# Altium project Power Supply.PrjPcb (part 1 of 3)
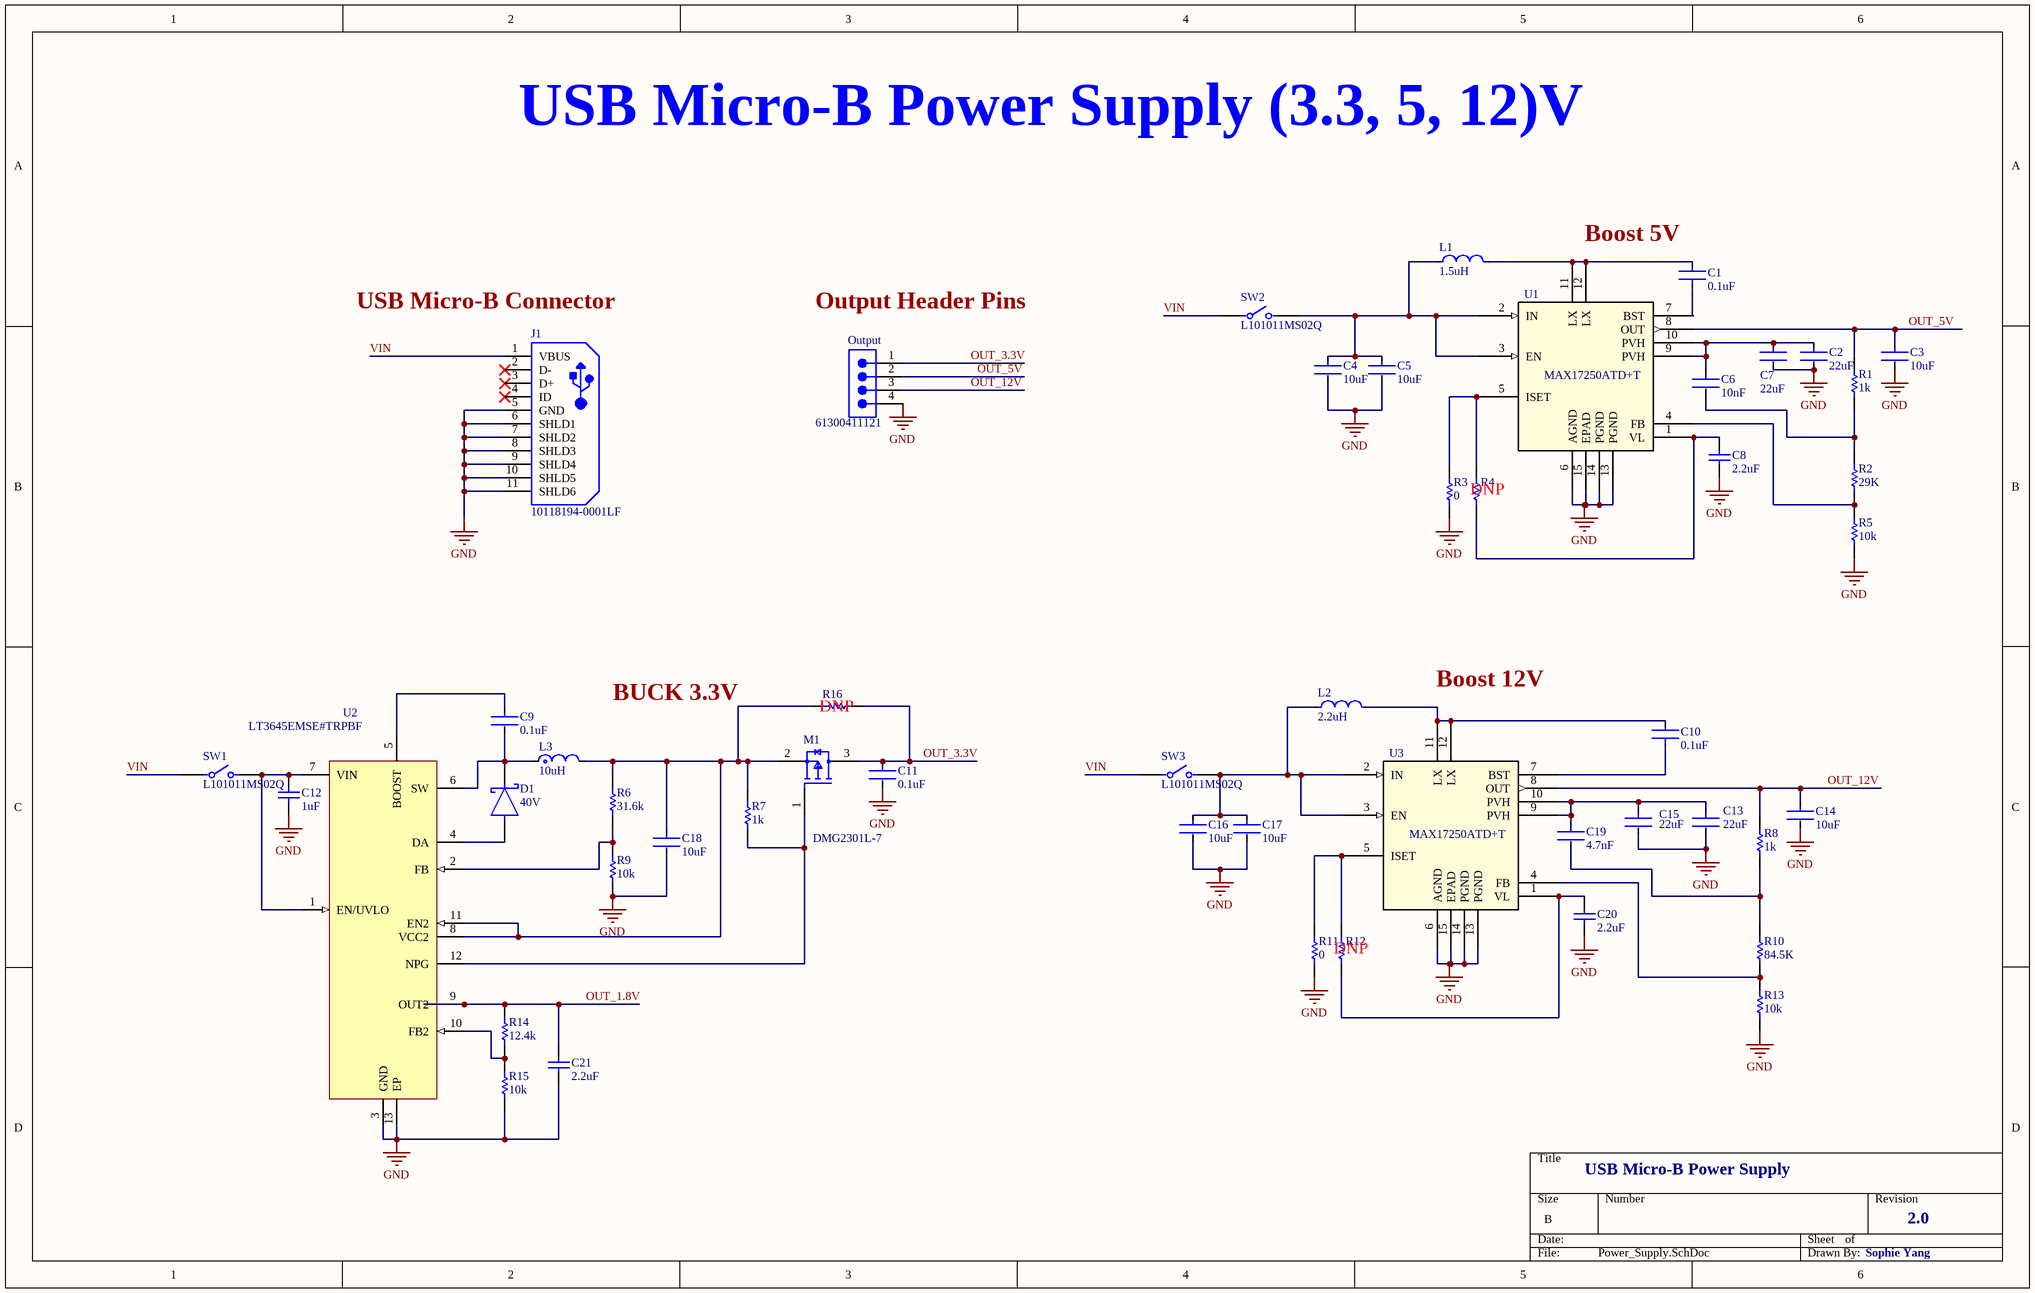
[diagram p0: Power_Supply.SchDoc]
1 sheet, 50 parts. Net scope: global (net labels, ports and power ports of the same name join across sheets).
Board file: Power_Supply.PcbDoc

## Sheet Power_Supply.SchDoc
size B; SheetNumber: 1; SheetTotal: 1

### Parts
C1  0.1uF  [CC0805KRX7R9BB104]
C2  22uF  [GRM21BR61C226ME44L]
C3  10uF  [GRM21BR61C106KE15K]
C4  10uF  [GRM21BR61C106KE15K]
C5  10uF  [GRM21BR61C106KE15K]
C6  10nF  [C0805C103K5RACTU]
C7  22uF  [GRM21BR61C226ME44L]
C8  2.2uF  [C0805C225M8RACTU]
C9  0.1uF  [CC0805KRX7R9BB104]
C10  0.1uF  [CC0805KRX7R9BB104]
C11  0.1uF  [CC0805KRX7R9BB104]
C12  1uF  [C0805C105K4RACTU]
C13  22uF  [GRM32ER71E226KE15L]
C14  10uF  [GRM21BZ71E106KE15L]
C15  22uF  [GRM32ER71E226KE15L]
C16  10uF  [GRM21BR61C106KE15K]
C17  10uF  [GRM21BR61C106KE15K]
C18  10uF  [GRM21BR61C106KE15K]
C19  4.7nF  [CC0805KRX7R9BB472]
C20  2.2uF  [C0805C225M8RACTU]
C21  2.2uF  [C0805C225M8RACTU]
D1  40V  [B5819WS-TP]
J1  10118194-0001LF  [10118194-0001LF]
L1  1.5uH  [IHLP2020CZER1R5M11]
L2  2.2uH  [IHLP2020CZER2R2M11]
L3  10uH  [VLS6045EX-100M]
M1  DMG2301L-7  [DMG2301L-7]
Output  61300411121  [61300411121]
R1  1k  [RC0805FR-071KL]
R2  29K  [CRCW080528K7FKEA]
R3  0  [CRCW08050000Z0EA]
R4  DNP  [CRCW08050000Z0EA]
R5  10k  [CRCW080510K0FKEA]
R6  31.6k  [RC0805FR-0731K6L]
R7  1k  [RC0805FR-071KL]
R8  1k  [RC0805FR-071KL]
R9  10k  [CRCW080510K0FKEA]
R10  84.5K  [CRCW080584K5FKEA]
R11  0  [CRCW08050000Z0EA]
R12  DNP  [CRCW08050000Z0EA]
R13  10k  [CRCW080510K0FKEA]
R14  12.4k  [CRCW080512K4FKEA]
R15  10k  [CRCW080510K0FKEA]
R16  DNP  [CRCW08050000Z0EA]
SW1  L101011MS02Q  [FP-L101011MS02Q-MFG]
SW2  L101011MS02Q  [FP-L101011MS02Q-MFG]
SW3  L101011MS02Q  [FP-L101011MS02Q-MFG]
U1  MAX17250ATD+T  [MAX17250ATD+T]
U2  LT3645EMSE#TRPBF  [LT3645EMSE#TRPBF]
U3  MAX17250ATD+T  [MAX17250ATD+T]

### Nets
GND: C2.2 C3.2 C4.2 C5.2 C7.2 C8.2 C11.2 C12.2 C13.2 C14.2 C15.2 C16.2 C17.2 C18.2 C20.2 C21.1 J1.5(GND) J1.6(SHLD1) J1.7(SHLD2) J1.8(SHLD3) J1.9(SHLD4) J1.10(SHLD5) J1.11(SHLD6) Output.4 R3.2 R5.1 R9.1 R11.2 R13.1 R15.1 U1.6(AGND) U1.13(PGND) U1.14(PGND) U1.15(EPAD) U2.3(GND) U2.13(EP) U3.6(AGND) U3.13(PGND) U3.14(PGND) U3.15(EPAD)
OUT_1.8V: C21.2 R14.2 U2.9(OUT2)
OUT_3.3V: C11.1 M1.3(D) Output.1 R16.2
OUT_5V: C3.1 Output.2 R1.2 U1.8(OUT)
OUT_12V: C14.1 Output.3 R8.2 U3.8(OUT)
VIN: J1.1(VBUS) SW1.1 SW2.1 SW3.1
NetC1_1: C1.1 U1.7(BST)
NetC1_2: C1.2 L1.2 U1.11(LX) U1.12(LX)
NetC2_1: C2.1 C6.1 C7.1 U1.9(PVH) U1.10(PVH)
NetC4_1: C4.1 C5.1 L1.1 SW2.2 U1.2(IN) U1.3(EN)
NetC6_2: C6.2 R1.1 R2.2
NetC8_1: C8.1 R4.2 U1.1(VL)
NetC9_1: C9.1 U2.5(BOOST)
NetC9_2: C9.2 D1.1(C) L3.1 U2.6(SW)
NetC10_1: C10.1 U3.7(BST)
NetC10_2: C10.2 L2.2 U3.11(LX) U3.12(LX)
NetC12_1: C12.1 SW1.2 U2.1(EN/UVLO) U2.7(VIN)
NetC13_1: C13.1 C15.1 C19.1 U3.9(PVH) U3.10(PVH)
NetC16_1: C16.1 C17.1 L2.1 SW3.2 U3.2(IN) U3.3(EN)
NetC18_1: C18.1 L3.2 M1.2(S) R6.2 R7.2 R16.1 U2.8(VCC2) U2.11(EN2)
NetC19_2: C19.2 R8.1 R10.2
NetC20_1: C20.1 R12.2 U3.1(VL)
NetD1_2: D1.2(A) U2.4(DA)
NetM1_1: M1.1(G) R7.1 U2.12(NPG)
NetR2_1: R2.1 R5.2 U1.4(FB)
NetR3_1: R3.1 R4.1 U1.5(ISET)
NetR6_1: R6.1 R9.2 U2.2(FB)
NetR10_1: R10.1 R13.2 U3.4(FB)
NetR11_1: R11.1 R12.1 U3.5(ISET)
NetR14_1: R14.1 R15.2 U2.10(FB2)

Not connected (* = marked no-connect by the designer): J1 2(D-)* 3(D+)* 4(ID)*

### Notes on the sheet
- USB Micro-B Power Supply (3.3, 5, 12)V
- (near C1) Boost 5V
- (near J1) USB Micro-B Connector
- (near Output) Output Header Pins
- BUCK 3.3V
- Boost 12V
- USB Micro-B Power Supply
- 2.0
- Sophie Yang